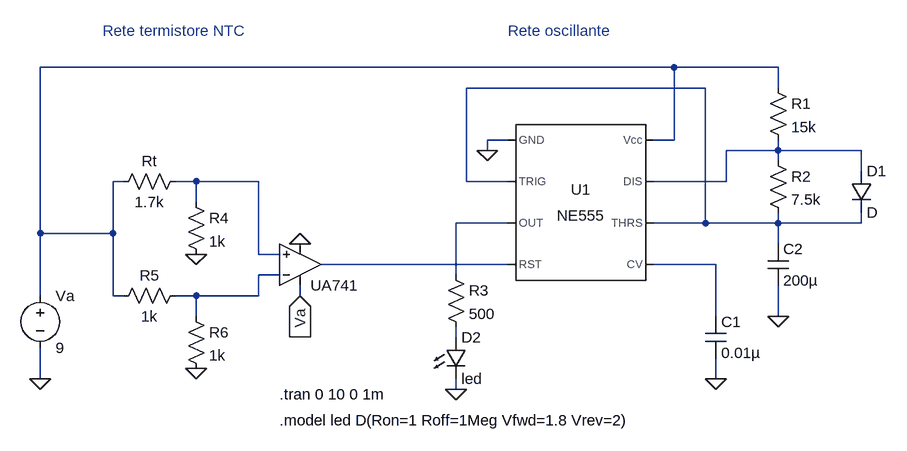
[diagram p0: schematic progetto_completo.asc]
progetto_completo.asc, the LTspice schematic file:
Version 4
SHEET 1 1140 680
WIRE 432 -160 -544 -160
WIRE 592 -160 432 -160
WIRE 480 -128 112 -128
WIRE 592 -128 592 -160
WIRE 176 -48 144 -48
WIRE 432 -48 432 -160
WIRE 432 -48 400 -48
WIRE 144 -32 144 -48
WIRE 592 -32 592 -48
WIRE 592 -32 512 -32
WIRE 720 -32 592 -32
WIRE 592 -16 592 -32
WIRE 720 0 720 -32
WIRE -416 16 -432 16
WIRE -304 16 -336 16
WIRE -208 16 -304 16
WIRE 112 16 112 -128
WIRE 176 16 112 16
WIRE 512 16 512 -32
WIRE 512 16 400 16
WIRE -304 48 -304 16
WIRE 176 80 96 80
WIRE 480 80 480 -128
WIRE 480 80 400 80
WIRE 592 80 592 64
WIRE 592 80 480 80
WIRE 720 80 720 64
WIRE 720 80 592 80
WIRE -544 96 -544 -160
WIRE -432 96 -432 16
WIRE -432 96 -544 96
WIRE 592 112 592 80
WIRE -208 128 -208 16
WIRE -176 128 -208 128
WIRE 176 144 -112 144
WIRE 496 144 400 144
WIRE -176 160 -208 160
WIRE 96 160 96 80
WIRE -544 192 -544 96
WIRE -432 192 -432 96
WIRE -416 192 -432 192
WIRE -304 192 -336 192
WIRE -208 192 -208 160
WIRE -208 192 -304 192
WIRE -144 192 -144 176
WIRE -304 224 -304 192
WIRE 496 224 496 144
WIRE 592 224 592 176
WIRE 96 256 96 240
WIRE -544 320 -544 272
WIRE 496 320 496 288
WIRE 96 336 96 320
FLAG 592 224 0
FLAG -304 128 0
FLAG -304 304 0
FLAG -544 320 0
FLAG 96 336 0
FLAG 496 320 0
FLAG -144 112 0
FLAG 144 -32 0
FLAG -144 192 Va
IOPIN -144 192 In
SYMBOL Misc\\NE555 288 48 R0
SYMATTR InstName U1
SYMBOL res 576 -32 R0
SYMATTR InstName R2
SYMATTR Value 7.5k
SYMBOL res 576 -144 R0
SYMATTR InstName R1
SYMATTR Value 15k
SYMBOL cap 576 112 R0
SYMATTR InstName C2
SYMATTR Value 200µ
SYMBOL diode 704 0 R0
SYMATTR InstName D1
SYMBOL OpAmps\\UniversalOpAmp2 -144 144 M180
SYMATTR InstName UA741
SYMBOL res -320 32 R0
SYMATTR InstName R4
SYMATTR Value 1k
SYMBOL res -320 0 R90
WINDOW 0 0 56 VBottom 2
WINDOW 3 32 56 VTop 2
SYMATTR InstName Rt
SYMATTR Value 1.7k
SYMBOL res -320 208 R0
SYMATTR InstName R6
SYMATTR Value 1k
SYMBOL res -320 176 R90
WINDOW 0 0 56 VBottom 2
WINDOW 3 32 56 VTop 2
SYMATTR InstName R5
SYMATTR Value 1k
SYMBOL voltage -544 176 R0
WINDOW 123 0 0 Left 0
WINDOW 39 0 0 Left 0
SYMATTR InstName Va
SYMATTR Value 9
SYMBOL LED 80 256 R0
SYMATTR InstName D2
SYMATTR Value led
SYMBOL cap 480 224 R0
SYMATTR InstName C1
SYMATTR Value 0.01µ
SYMBOL res 80 144 R0
SYMATTR InstName R3
SYMATTR Value 500
TEXT -176 344 Left 2 !.tran 0 10 0 1m
TEXT -448 -216 Left 2 ;Rete termistore NTC
TEXT 176 -216 Left 2 ;Rete oscillante
TEXT -176 384 Left 2 !.model led D(Ron=1 Roff=1Meg Vfwd=1.8 Vrev=2)

The netlist it stands for:
* progetto_completo.asc
XU1 0 N002 N005 N006 N007 N002 N003 N001 NE555  ; pins GND TRIG OUT RST CV THRS DIS Vcc
R2 N003 N002 7.5k
R1 N001 N003 15k
C2 N002 0 200µ
D1 N003 N002 D
XUA741 N004 N008 Va 0 N006 level2 Avol=1Meg GBW=10Meg Slew=10Meg Ilimit=25m Rail=0 Vos=0 En=0 Enk=0 In=0 Ink=0 Rin=500Meg  ; pins In+ In- V+ V- OUT
R4 N004 0 1k
Rt N004 N001 1.7k
R6 N008 0 1k
R5 N008 N001 1k
Va N001 0 9
D2 N009 0 led
C1 N007 0 0.01µ
R3 N005 N009 500
.model D D
.lib standard.dio
.tran 0 10 0 1m
* Rete termistore NTC
* Rete oscillante
.model led D(Ron=1 Roff=1Meg Vfwd=1.8 Vrev=2)
.lib NE555.sub
.lib UniversalOpAmp2.lib
.backanno
.end